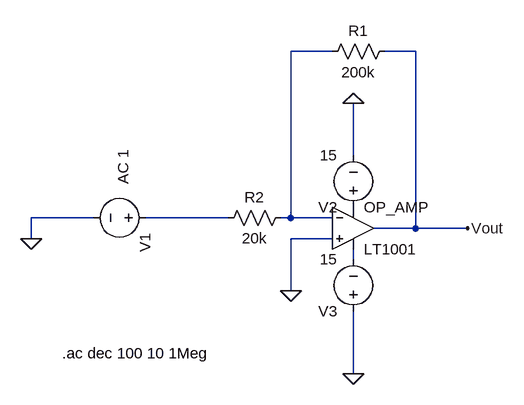
[diagram p0: schematic Q2 Inverting.asc]
Q2 Inverting.asc, the LTspice schematic file:
Version 4.1
SHEET 1 880 680
WIRE 224 -176 160 -176
WIRE 352 -176 304 -176
WIRE 256 -16 256 -96
WIRE -144 80 -240 80
WIRE 64 80 -64 80
WIRE 160 80 160 -176
WIRE 160 80 144 80
WIRE 224 80 160 80
WIRE 352 96 352 -176
WIRE 352 96 288 96
WIRE 432 96 352 96
WIRE -240 112 -240 80
WIRE 224 112 160 112
WIRE 256 144 256 128
WIRE 160 192 160 112
WIRE 256 320 256 224
FLAG -240 112 0
FLAG 160 192 0
FLAG 256 320 0
FLAG 256 -96 0
FLAG 432 96 Vout
SYMBOL OpAmps\\LT1001 256 32 R0
SYMATTR InstName OP_AMP
SYMBOL res 320 -192 R90
WINDOW 0 0 56 VBottom 2
WINDOW 3 32 56 VTop 2
SYMATTR InstName R1
SYMATTR Value 200k
SYMBOL res 160 64 R90
WINDOW 0 0 56 VBottom 2
WINDOW 3 32 56 VTop 2
SYMATTR InstName R2
SYMATTR Value 20k
SYMBOL voltage -48 80 R90
WINDOW 3 -225 55 Left 2
WINDOW 123 -105 50 Left 2
WINDOW 39 0 0 Left 0
SYMATTR Value ""
SYMATTR Value2 AC 1
SYMATTR InstName V1
SYMBOL voltage 256 80 R180
WINDOW 123 0 0 Left 0
WINDOW 39 0 0 Left 0
SYMATTR InstName V2
SYMATTR Value 15
SYMBOL voltage 256 240 R180
WINDOW 123 0 0 Left 0
WINDOW 39 0 0 Left 0
SYMATTR InstName V3
SYMATTR Value 15
TEXT -192 288 Left 2 !.ac dec 100 10 1Meg

The netlist it stands for:
* Q2 Inverting.asc
X§OP_AMP 0 N001 P001 N003 Vout LT1001  ; pins In+ In- V+ V- OUT
R1 Vout N001 200k
R2 N001 N002 20k
V1 N002 0 AC 1
V2 P001 0 15
V3 0 N003 15
.ac dec 100 10 1Meg
.lib LTC.lib
.backanno
.end